# Altium schematic sheet Acoustic_Cam.SchDoc
size A
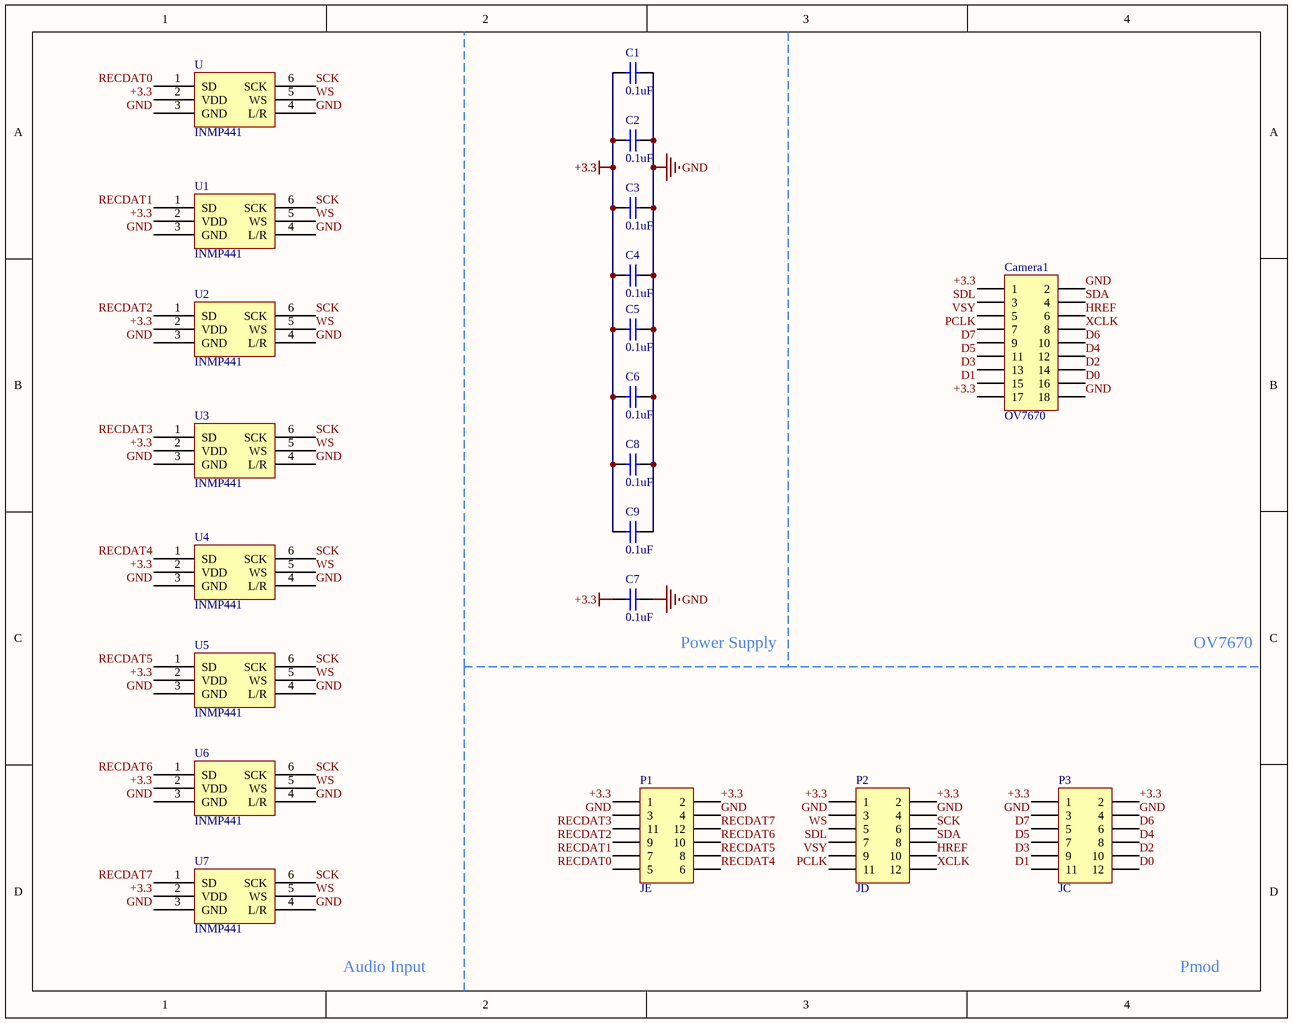
[diagram p0: Acoustic_Cam.SchDoc]

## Parts
C1  0.1uF  [0603-1]
C2  0.1uF  [0603-1]
C3  0.1uF  [0603-1]
C4  0.1uF  [0603-1]
C5  0.1uF  [0603-1]
C6  0.1uF  [0603-1]
C7  0.1uF  [0603-1]
C8  0.1uF  [0603-1]
C9  0.1uF  [0603-1]
Camera1  OV7670  [HDR2X9]
P1  JE  [HDR2X6]
P2  JD  [HDR2X6]
P3  JC  [HDR2X6]
U  INMP441  [INMP441board]
U1  INMP441  [INMP441board]
U2  INMP441  [INMP441board]
U3  INMP441  [INMP441board]
U4  INMP441  [INMP441board]
U5  INMP441  [INMP441board]
U6  INMP441  [INMP441board]
U7  INMP441  [INMP441board]

## Nets
+3.3: C1.1 C2.1 C3.1 C4.1 C5.1 C6.1 C7.1 C8.1 C9.1 Camera1.1 Camera1.17 P1.1 P1.2 P2.1 P2.2 P3.1 P3.2 U.2(VDD) U1.2(VDD) U2.2(VDD) U3.2(VDD) U4.2(VDD) U5.2(VDD) U6.2(VDD) U7.2(VDD)
GND: C1.2 C2.2 C3.2 C4.2 C5.2 C6.2 C7.2 C8.2 C9.2 Camera1.2 Camera1.18 P1.3 P1.4 P2.3 P2.4 P3.3 P3.4 U.3(GND) U.4(L/R) U1.3(GND) U1.4(L/R) U2.3(GND) U2.4(L/R) U3.3(GND) U3.4(L/R) U4.3(GND) U4.4(L/R) U5.3(GND) U5.4(L/R) U6.3(GND) U6.4(L/R) U7.3(GND) U7.4(L/R)
D0: Camera1.16 P3.12
D1: Camera1.15 P3.11
D2: Camera1.14 P3.10
D3: Camera1.13 P3.9
D4: Camera1.12 P3.8
D5: Camera1.11 P3.7
D6: Camera1.10 P3.6
D7: Camera1.9 P3.5
HREF: Camera1.6 P2.10
PCLK: Camera1.7 P2.11
RECDAT0: P1.5 U.1(SD)
RECDAT1: P1.7 U1.1(SD)
RECDAT2: P1.9 U2.1(SD)
RECDAT3: P1.11 U3.1(SD)
RECDAT4: P1.6 U4.1(SD)
RECDAT5: P1.8 U5.1(SD)
RECDAT6: P1.10 U6.1(SD)
RECDAT7: P1.12 U7.1(SD)
SCK: P2.6 U.6(SCK) U1.6(SCK) U2.6(SCK) U3.6(SCK) U4.6(SCK) U5.6(SCK) U6.6(SCK) U7.6(SCK)
SDA: Camera1.4 P2.8
SDL: Camera1.3 P2.7
VSY: Camera1.5 P2.9
WS: P2.5 U.5(WS) U1.5(WS) U2.5(WS) U3.5(WS) U4.5(WS) U5.5(WS) U6.5(WS) U7.5(WS)
XCLK: Camera1.8 P2.12

## Notes on the sheet
- (near C7) Power Supply
- OV7670
- Audio Input
- Pmod

## Library data of the parts
C1-C9 = Cap: Capacitor; Published: 8-Jun-2000; LatestRevisionDate: 17-Jul-2002; LatestRevisionNote: Re-released for DXP Platform.; PackageReference: RAD-0.3; Publisher: Altium Limited; Value: 0.1uF
Camera1 = Header 9X2: Header, 9-Pin, Dual row; LatestRevisionDate: 17-Jul-2002; LatestRevisionNote: Re-released for DXP Platform.; Publisher: Altium Limited
P1-P3 = Header 6X2: Header, 6-Pin, Dual row; LatestRevisionDate: 17-Jul-2002; LatestRevisionNote: Re-released for DXP Platform.; Publisher: Altium Limited